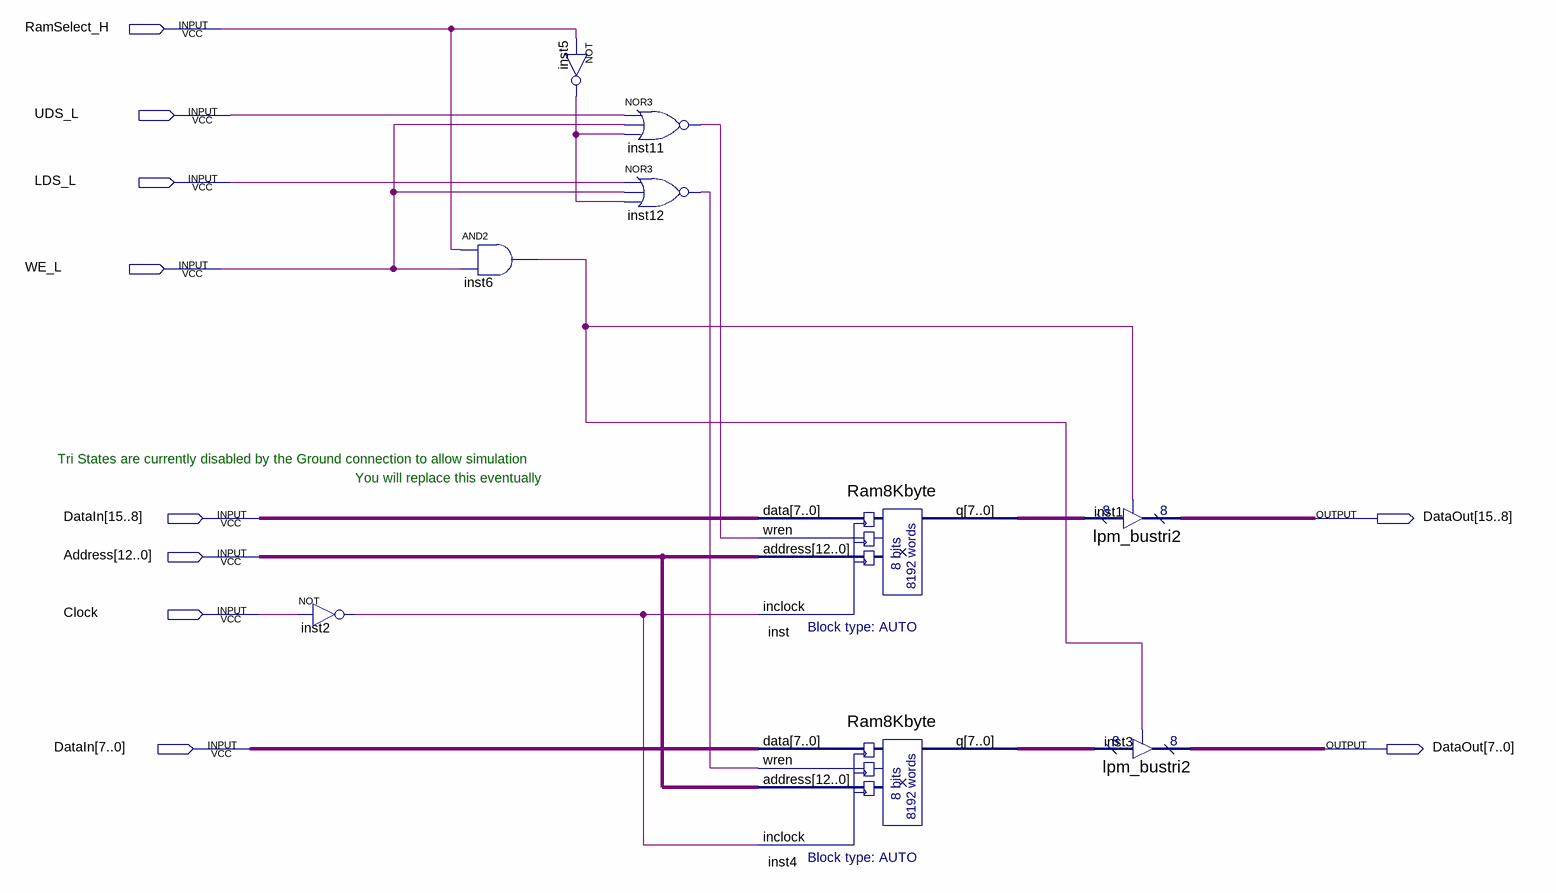
[diagram p0: schematic sheet]
// Quartus schematic OnChip16KbyteRam.bdf as structural Verilog: 9 symbols, 10 pins
module OnChip16KbyteRam (
  input  RamSelect_H,
  input  UDS_L,
  input  LDS_L,
  input  WE_L,
  input  [15:0] DataIn,
  input  [12:0] Address,
  input  Clock,
  output [15:0] DataOut
);

  wire inst2_out, inst5_out, inst6_out, inst11_out, inst12_out;
  wire [7:0] inst4_q, inst_q;

  not inst2 (inst2_out, Clock);
  and inst6 (inst6_out, RamSelect_H, WE_L);
  not inst5 (inst5_out, RamSelect_H);
  nor inst11 (inst11_out, UDS_L, WE_L, inst5_out);
  nor inst12 (inst12_out, LDS_L, WE_L, inst5_out);
  Ram8Kbyte inst (.data(DataIn[15:8]), .wren(inst11_out), .address(Address), .inclock(inst2_out), .q(inst_q));
  Ram8Kbyte inst4 (.data(DataIn[7:0]), .wren(inst12_out), .address(Address), .inclock(inst2_out), .q(inst4_q));
  lpm_bustri2 inst1 (.enabledt(inst6_out), .data(inst_q), .tridata(DataOut[15:8]));
  lpm_bustri2 inst3 (.enabledt(inst6_out), .data(inst4_q), .tridata(DataOut[7:0]));

  // Notes on the sheet:
  //   Tri States are currently disabled by the Ground connection to allow simulation
  //   You will replace this eventually
endmodule
